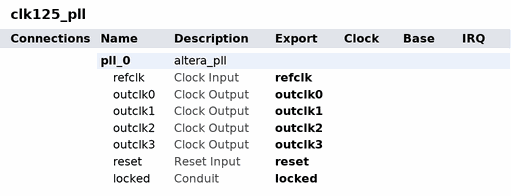
[diagram p0: system contents]
# Platform Designer (Qsys) system clk125_pll, Arria V GZ 5AGZME3H2F35C3
# Parameters at their usual value, and those the tool derives, are not listed.
package require -exact qsys 23.1
create_system clk125_pll
set_project_property DEVICE_FAMILY {Arria V GZ}
set_project_property DEVICE 5AGZME3H2F35C3

add_instance pll_0 altera_pll 23.1
set_instance_parameter_value pll_0 gui_device_speed_grade 2
set_instance_parameter_value pll_0 gui_number_of_clocks 4
set_instance_parameter_value pll_0 gui_operation_mode direct
set_instance_parameter_value pll_0 gui_output_clock_frequency0 300.0
set_instance_parameter_value pll_0 gui_output_clock_frequency1 150.0
set_instance_parameter_value pll_0 gui_output_clock_frequency2 125.0
set_instance_parameter_value pll_0 gui_output_clock_frequency3 214.285714
set_instance_parameter_value pll_0 gui_pll_mode {Integer-N PLL}
set_instance_parameter_value pll_0 gui_reference_clock_frequency 125.0
set_instance_parameter_value pll_0 gui_use_locked true

# exported interfaces
add_interface locked conduit end
set_interface_property locked EXPORT_OF pll_0.locked
add_interface outclk0 clock source
set_interface_property outclk0 EXPORT_OF pll_0.outclk0
add_interface outclk1 clock source
set_interface_property outclk1 EXPORT_OF pll_0.outclk1
add_interface outclk2 clock source
set_interface_property outclk2 EXPORT_OF pll_0.outclk2
add_interface outclk3 clock source
set_interface_property outclk3 EXPORT_OF pll_0.outclk3
add_interface refclk clock sink
set_interface_property refclk EXPORT_OF pll_0.refclk
add_interface reset reset sink
set_interface_property reset EXPORT_OF pll_0.reset

set_interconnect_requirement {$system} qsys_mm.clockCrossingAdapter HANDSHAKE
set_interconnect_requirement {$system} qsys_mm.enableEccProtection FALSE
set_interconnect_requirement {$system} qsys_mm.insertDefaultSlave FALSE
set_interconnect_requirement {$system} qsys_mm.maxAdditionalLatency 1

save_system clk125_pll.qsys
